# EasyEDA Pro project ws2812_clock_PCB.epro, schematic ws2812_broad
Create Date: 2024-04-24; Page Name: P1; Project Name: ws2812_clock; Schematic Name: ws2812_broad; Update Date: 2024-05-06; Company: 嘉立创EDA; Page Size: A3; Version: V1.0
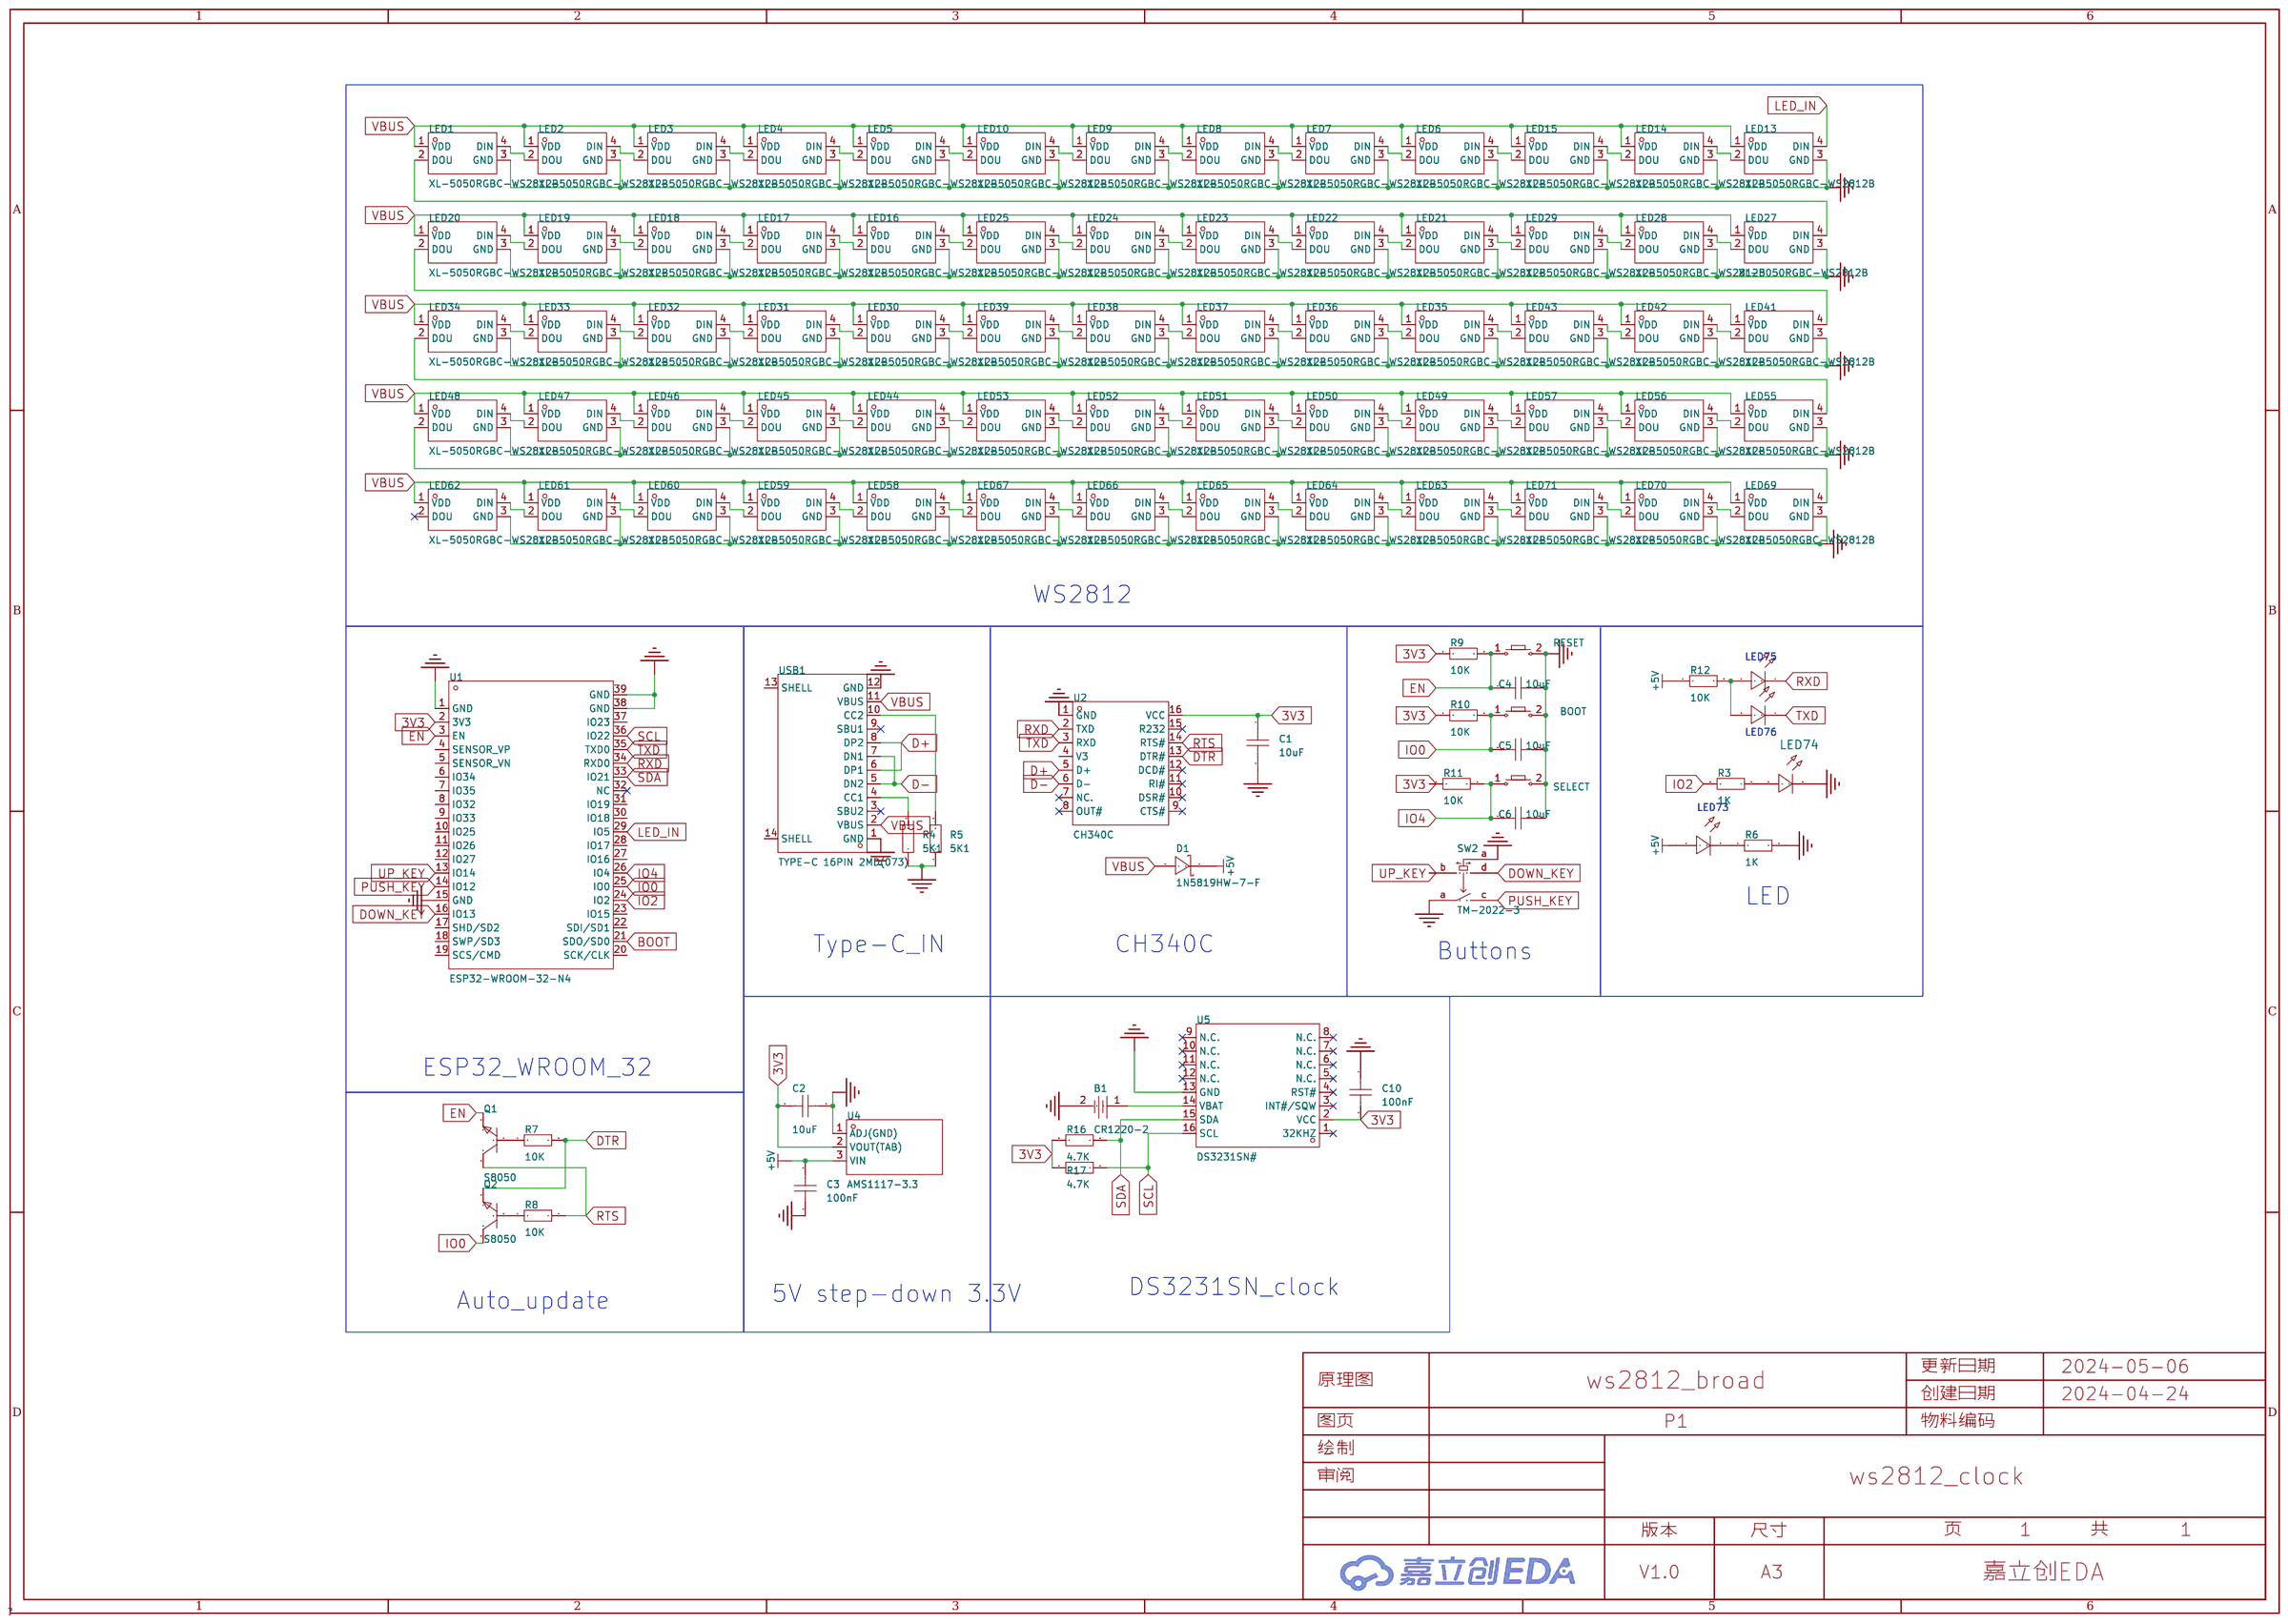
[diagram p1: schematic sheet]

## Parts
B1  CR1220-2  [BAT-SMD_CR1220-2]
BOOT  -  [Key_SMD_3x4x2]
C1  10uF  [C0603]
C2  10uF  [C0603]
C3  100nF  [C0603]
C4  10uF  [C0603]
C5  10uF  [C0603]
C6  10uF  [C0603]
C10  100nF  [C0603]
D1  1N5819HW-7-F  [SOD-123_L2.7-W1.6-LS3.7-RD]
LED1  XL-5050RGBC-WS2812B  [LED-SMD_4P-L5.0-W5.0-BL_XL-5050RGBC]
LED2  XL-5050RGBC-WS2812B  [LED-SMD_4P-L5.0-W5.0-BL_XL-5050RGBC]
LED3  XL-5050RGBC-WS2812B  [LED-SMD_4P-L5.0-W5.0-BL_XL-5050RGBC]
LED4  XL-5050RGBC-WS2812B  [LED-SMD_4P-L5.0-W5.0-BL_XL-5050RGBC]
LED5  XL-5050RGBC-WS2812B  [LED-SMD_4P-L5.0-W5.0-BL_XL-5050RGBC]
LED6  XL-5050RGBC-WS2812B  [LED-SMD_4P-L5.0-W5.0-BL_XL-5050RGBC]
LED7  XL-5050RGBC-WS2812B  [LED-SMD_4P-L5.0-W5.0-BL_XL-5050RGBC]
LED8  XL-5050RGBC-WS2812B  [LED-SMD_4P-L5.0-W5.0-BL_XL-5050RGBC]
LED9  XL-5050RGBC-WS2812B  [LED-SMD_4P-L5.0-W5.0-BL_XL-5050RGBC]
LED10  XL-5050RGBC-WS2812B  [LED-SMD_4P-L5.0-W5.0-BL_XL-5050RGBC]
LED13  XL-5050RGBC-WS2812B  [LED-SMD_4P-L5.0-W5.0-BL_XL-5050RGBC]
LED14  XL-5050RGBC-WS2812B  [LED-SMD_4P-L5.0-W5.0-BL_XL-5050RGBC]
LED15  XL-5050RGBC-WS2812B  [LED-SMD_4P-L5.0-W5.0-BL_XL-5050RGBC]
LED16  XL-5050RGBC-WS2812B  [LED-SMD_4P-L5.0-W5.0-BL_XL-5050RGBC]
LED17  XL-5050RGBC-WS2812B  [LED-SMD_4P-L5.0-W5.0-BL_XL-5050RGBC]
LED18  XL-5050RGBC-WS2812B  [LED-SMD_4P-L5.0-W5.0-BL_XL-5050RGBC]
LED19  XL-5050RGBC-WS2812B  [LED-SMD_4P-L5.0-W5.0-BL_XL-5050RGBC]
LED20  XL-5050RGBC-WS2812B  [LED-SMD_4P-L5.0-W5.0-BL_XL-5050RGBC]
LED21  XL-5050RGBC-WS2812B  [LED-SMD_4P-L5.0-W5.0-BL_XL-5050RGBC]
LED22  XL-5050RGBC-WS2812B  [LED-SMD_4P-L5.0-W5.0-BL_XL-5050RGBC]
LED23  XL-5050RGBC-WS2812B  [LED-SMD_4P-L5.0-W5.0-BL_XL-5050RGBC]
LED24  XL-5050RGBC-WS2812B  [LED-SMD_4P-L5.0-W5.0-BL_XL-5050RGBC]
LED25  XL-5050RGBC-WS2812B  [LED-SMD_4P-L5.0-W5.0-BL_XL-5050RGBC]
LED27  XL-5050RGBC-WS2812B  [LED-SMD_4P-L5.0-W5.0-BL_XL-5050RGBC]
LED28  XL-5050RGBC-WS2812B  [LED-SMD_4P-L5.0-W5.0-BL_XL-5050RGBC]
LED29  XL-5050RGBC-WS2812B  [LED-SMD_4P-L5.0-W5.0-BL_XL-5050RGBC]
LED30  XL-5050RGBC-WS2812B  [LED-SMD_4P-L5.0-W5.0-BL_XL-5050RGBC]
LED31  XL-5050RGBC-WS2812B  [LED-SMD_4P-L5.0-W5.0-BL_XL-5050RGBC]
LED32  XL-5050RGBC-WS2812B  [LED-SMD_4P-L5.0-W5.0-BL_XL-5050RGBC]
LED33  XL-5050RGBC-WS2812B  [LED-SMD_4P-L5.0-W5.0-BL_XL-5050RGBC]
LED34  XL-5050RGBC-WS2812B  [LED-SMD_4P-L5.0-W5.0-BL_XL-5050RGBC]
LED35  XL-5050RGBC-WS2812B  [LED-SMD_4P-L5.0-W5.0-BL_XL-5050RGBC]
LED36  XL-5050RGBC-WS2812B  [LED-SMD_4P-L5.0-W5.0-BL_XL-5050RGBC]
LED37  XL-5050RGBC-WS2812B  [LED-SMD_4P-L5.0-W5.0-BL_XL-5050RGBC]
LED38  XL-5050RGBC-WS2812B  [LED-SMD_4P-L5.0-W5.0-BL_XL-5050RGBC]
LED39  XL-5050RGBC-WS2812B  [LED-SMD_4P-L5.0-W5.0-BL_XL-5050RGBC]
LED41  XL-5050RGBC-WS2812B  [LED-SMD_4P-L5.0-W5.0-BL_XL-5050RGBC]
LED42  XL-5050RGBC-WS2812B  [LED-SMD_4P-L5.0-W5.0-BL_XL-5050RGBC]
LED43  XL-5050RGBC-WS2812B  [LED-SMD_4P-L5.0-W5.0-BL_XL-5050RGBC]
LED44  XL-5050RGBC-WS2812B  [LED-SMD_4P-L5.0-W5.0-BL_XL-5050RGBC]
LED45  XL-5050RGBC-WS2812B  [LED-SMD_4P-L5.0-W5.0-BL_XL-5050RGBC]
LED46  XL-5050RGBC-WS2812B  [LED-SMD_4P-L5.0-W5.0-BL_XL-5050RGBC]
LED47  XL-5050RGBC-WS2812B  [LED-SMD_4P-L5.0-W5.0-BL_XL-5050RGBC]
LED48  XL-5050RGBC-WS2812B  [LED-SMD_4P-L5.0-W5.0-BL_XL-5050RGBC]
LED49  XL-5050RGBC-WS2812B  [LED-SMD_4P-L5.0-W5.0-BL_XL-5050RGBC]
LED50  XL-5050RGBC-WS2812B  [LED-SMD_4P-L5.0-W5.0-BL_XL-5050RGBC]
LED51  XL-5050RGBC-WS2812B  [LED-SMD_4P-L5.0-W5.0-BL_XL-5050RGBC]
LED52  XL-5050RGBC-WS2812B  [LED-SMD_4P-L5.0-W5.0-BL_XL-5050RGBC]
LED53  XL-5050RGBC-WS2812B  [LED-SMD_4P-L5.0-W5.0-BL_XL-5050RGBC]
LED55  XL-5050RGBC-WS2812B  [LED-SMD_4P-L5.0-W5.0-BL_XL-5050RGBC]
LED56  XL-5050RGBC-WS2812B  [LED-SMD_4P-L5.0-W5.0-BL_XL-5050RGBC]
LED57  XL-5050RGBC-WS2812B  [LED-SMD_4P-L5.0-W5.0-BL_XL-5050RGBC]
LED58  XL-5050RGBC-WS2812B  [LED-SMD_4P-L5.0-W5.0-BL_XL-5050RGBC]
LED59  XL-5050RGBC-WS2812B  [LED-SMD_4P-L5.0-W5.0-BL_XL-5050RGBC]
LED60  XL-5050RGBC-WS2812B  [LED-SMD_4P-L5.0-W5.0-BL_XL-5050RGBC]
LED61  XL-5050RGBC-WS2812B  [LED-SMD_4P-L5.0-W5.0-BL_XL-5050RGBC]
LED62  XL-5050RGBC-WS2812B  [LED-SMD_4P-L5.0-W5.0-BL_XL-5050RGBC]
LED63  XL-5050RGBC-WS2812B  [LED-SMD_4P-L5.0-W5.0-BL_XL-5050RGBC]
LED64  XL-5050RGBC-WS2812B  [LED-SMD_4P-L5.0-W5.0-BL_XL-5050RGBC]
LED65  XL-5050RGBC-WS2812B  [LED-SMD_4P-L5.0-W5.0-BL_XL-5050RGBC]
LED66  XL-5050RGBC-WS2812B  [LED-SMD_4P-L5.0-W5.0-BL_XL-5050RGBC]
LED67  XL-5050RGBC-WS2812B  [LED-SMD_4P-L5.0-W5.0-BL_XL-5050RGBC]
LED69  XL-5050RGBC-WS2812B  [LED-SMD_4P-L5.0-W5.0-BL_XL-5050RGBC]
LED70  XL-5050RGBC-WS2812B  [LED-SMD_4P-L5.0-W5.0-BL_XL-5050RGBC]
LED71  XL-5050RGBC-WS2812B  [LED-SMD_4P-L5.0-W5.0-BL_XL-5050RGBC]
LED73  -  [LED_0603]
LED74  -  [LED_0603]
LED75  -  [LED_0603]
LED76  -  [LED_0603]
Q1  S8050  [SOT-23-3_L2.9-W1.3-P1.90-LS2.4-BR]
Q2  S8050  [SOT-23-3_L2.9-W1.3-P1.90-LS2.4-BR]
R3  1K  [R0603]
R4  5K1  [R0603]
R5  5K1  [R0603]
R6  1K  [R0603]
R7  10K  [R0603]
R8  10K  [R0603]
R9  10K  [R0603]
R10  10K  [R0603]
R11  10K  [R0603]
R12  10K  [R0603]
R16  4.7K  [R0603]
R17  4.7K  [R0603]
RESET  -  [Key_SMD_3x4x2]
SELECT  -  [Key_SMD_3x4x2]
SW2  TM-2022-3  [SW-SMD_TM-2022-3]
U1  ESP32-WROOM-32-N4  [WIFIM-SMD_ESP32-WROOM-32-N4]
U2  CH340C  [SOP-16_L10.0-W3.9-P1.27-LS6.0-BL]
U4  AMS1117-3.3  [SOT-89_L4.5-W2.5-P1.50-LS4.2-BR]
U5  DS3231SN#  [SOIC-16_L10.3-W7.5-P1.27-LS10.3-BL]
USB1  TYPE-C 16PIN 2MD(073)  [USB-C-SMD_TYPE-C-6PIN-2MD-073]

## Library data of the parts
B1 = CR1220-2: 连接器类型:电池底座;适用电池规格:CR1220;工作温度范围:-;; LCSC Part Name: 电池底座 适用电池:CR1220; Supplier Part: C70381; Manufacturer: Q&J; Supplier Footprint: SMD; JLCPCB Part Class: 扩展库; Datasheet: https://atta.szlcsc.com/upload/public/pdf/source/20160427/1461725216696.pdf; Supplier: LCSC; Connector Type: 电池底座; Battery Type: CR1220
BOOT RESET SELECT = Key_SMD_3x4x2: Supplier Footprint: SMD
C1-C6 C10 = CAP_0603: Supplier Footprint: 0603
D1 = 1N5819HW-7-F: 正向压降(Vf):450mV@1A;直流反向耐压(Vr):40V;平均整流电流(Io):1A;; LCSC Part Name: 电压:40V 电流:1A; Supplier Part: C82544; Manufacturer: DIODES(美台); Supplier Footprint: SOD-123; JLCPCB Part Class: 扩展库; Datasheet: https://atta.szlcsc.com/upload/public/pdf/source/20161024/1477288459223.pdf; Supplier: LCSC; Forward Voltage (Vf@If): 450mV@1A; Reverse Voltage (Vr): 40V; Average Rectified Current (Io): 1A; Reverse Leakage Current (Ir): 1mA@40V
LED1-LED10 LED13-LED25 LED27-LED39 LED41-LED53 LED55-LED67 LED69-LED71 = XL-5050RGBC-WS2812B: 发光颜色:RGB三色;功率:-;正向电流:-;主波长:-;二极管配置:-;透镜颜色:无色透明透镜;色温:-;发光角度:120°;载带方式:正贴;工作温度:-20℃~+85℃;; Supplier Part: C2843785; Manufacturer: XINGLIGHT(成兴光); Supplier Footprint: SMD5050; JLCPCB Part Class: 扩展库; Datasheet: https://atta.szlcsc.com/upload/public/pdf/source/20230111/86AAD2096485A2E5BCAB883FF8CBE6FD.pdf; Supplier: LCSC; Emitted Color: RGB三色; Peak Wavelength: 625nm；470nm；530nm; Lens Color: 无色透明透镜; Viewing Angle: 120°; Mounting Sytle: 正贴; Operating Temperature: -20℃~+85℃
LED73 LED76 = LED_0603-B: Supplier Footprint: 0603
LED74 = LED_0603-R: Supplier Footprint: 0603
LED75 = LED_0603-G: Supplier Footprint: 0603
Q1 Q2 = S8050_C2891804: 晶体管类型:NPN;集电极电流(Ic):500mA;集射极击穿电压(Vceo):25V;功率(Pd):300mW;; LCSC Part Name: NPN 电流:500mA 耐压:25V; Supplier Part: C2891804; Manufacturer: YONGYUTAI(永裕泰); Supplier Footprint: SOT-23; JLCPCB Part Class: 扩展库; Datasheet: https://atta.szlcsc.com/upload/public/pdf/source/20210901/5347316A10609C628D4D69AE01446E5B.pdf; Supplier: LCSC; Transistor Type: NPN; Collector Current (Ic): 500mA; Collector-Emitter Breakdown Voltage (Vceo): 25V; Power Dissipation (Pd): 300mW; Collector Cut-Off Current (Icbo): 1uA; Collector-Emitter Saturation Voltage (VCE(sat)@Ic,Ib): 500mV@500mA,50mA
R3-R12 R16 R17 = Res_0603: Supplier Footprint: 0603
SW2 = TM-2022-3: 数码相机拨轮开关  3挡拨轮开关; LCSC Part Name: 数码相机拨轮开关  3挡拨轮开关; Supplier Part: C318952; Manufacturer: XKB Connectivity(中国星坤); Supplier Footprint: SMD-5P,11.4x12.8mm; JLCPCB Part Class: 扩展库; Datasheet: https://atta.szlcsc.com/upload/public/pdf/source/20211015/3476D939D9FB2BD124C91E3A6F460D4F.pdf; Supplier: LCSC
U1 = ESP32-WROOM-32-N4: WiFi+蓝牙4.2+双核CPU,ESP32; LCSC Part Name: WiFi+蓝牙4.2+双核CPU模块; Supplier Part: C82899; Manufacturer: ESPRESSIF(乐鑫); Supplier Footprint: SMD,18x25.5mm; JLCPCB Part Class: 扩展库; Datasheet: https://atta.szlcsc.com/upload/public/pdf/source/20210719/C82899_2D52724B6FAFABC419BCF308C5944296.pdf; Supplier: LCSC
U2 = CH340C: 应用功能:收发器;接口协议:USB 2.0;数据速率:2Mbps;; LCSC Part Name: CH340C USB转串口芯片 CH340; Supplier Part: C84681; Manufacturer: WCH(南京沁恒); Supplier Footprint: SOP-16; JLCPCB Part Class: 扩展库; Datasheet: https://atta.szlcsc.com/upload/public/pdf/source/20200819/C84681_ADBED554CE321879DBD6B1D06488689C.pdf; Supplier: LCSC; Applications Function: 收发器; Protocol: USB 2.0; Supply Voltage: 3.3V；5V; Data Rate: 2Mbps
U4 = AMS1117-3.3_C347256: 输出类型:固定;最大输入电压:12V;输出电压:3.3V;最大输出电流:1A;电源纹波抑制比(PSRR):60dB@(120Hz);输出极性:正极;; LCSC Part Name: 输出:3.3V 电流:1A 耐压:12V; Supplier Part: C347256; Manufacturer: UMW(友台半导体); Supplier Footprint: SOT-89; JLCPCB Part Class: 扩展库; Datasheet: https://atta.szlcsc.com/upload/public/pdf/source/20231109/155D79A26D9DB04352555A58D5969DC8.pdf; Supplier: LCSC; Output Type: 固定; Maximum Input Voltage: 12V; Output Voltage: 3.3V; MAX Output Current: 1A; Power Supply Rejection Ratio (PSRR): 60dB@(120Hz); Dropout Voltage: 1.3V@(1A); Output Polarity: 正极; Number of Outputs: 1
U5 = DS3231SN#: 接口:I2C;; Supplier Part: C722469; Manufacturer: ADI(亚德诺)/MAXIM(美信); Supplier Footprint: SOIC-16-300mil; JLCPCB Part Class: 扩展库; Datasheet: https://atta.szlcsc.com/upload/public/pdf/source/20170713/C118524_1499918908819816807.pdf; Supplier: LCSC; Interface: I2C; Operating Voltage: 2.3V~5.5V; Operating Temperature: -40℃~+85℃
USB1 = TYPE-C 16PIN 2MD(073): 连接器类型:Type-C;标准:-;公母:母;端口数量:1;触点数量:16P;安装方式:卧贴;额定电流 - 电源:5A;工作温度范围:-25℃~+85℃;; LCSC Part Name: Type-C 母 卧贴; Supplier Part: C2765186; Manufacturer: SHOU HAN(首韩); Supplier Footprint: SMD; JLCPCB Part Class: 扩展库; Datasheet: https://atta.szlcsc.com/upload/public/pdf/source/20211123/39B17C16241EAC15C5E277BDA434118E.pdf; Supplier: LCSC; Connector Type: Type-C; Gender: 母; Number of Ports: 1; Number of Contacts: 16P; Mounting Style: 卧贴; Current Rating - Power (Max): 5A; Operating Temperature Range: -25℃~+85℃

## Nets
3V3: C1.1 C2.1 C10.2 R9.1 R10.1 R11.1 R16.1 R17.1 U1.2(3V3) U2.16(VCC) U4.2(VOUT(TAB)) U5.2(VCC)
+5V: C3.2 D1.1(K) LED73.2(A) R12.1 U4.3(VIN)
GND: B1.2 BOOT.2 C1.2 C2.2 C3.1 C4.2 C5.2 C6.2 C10.1 LED1.3(GND) LED2.3(GND) LED3.3(GND) LED4.3(GND) LED5.3(GND) LED6.3(GND) LED7.3(GND) LED8.3(GND) LED9.3(GND) LED10.3(GND) LED13.3(GND) LED14.3(GND) LED15.3(GND) LED16.3(GND) LED17.3(GND) LED18.3(GND) LED19.3(GND) LED20.3(GND) LED21.3(GND) LED22.3(GND) LED23.3(GND) LED24.3(GND) LED25.3(GND) LED27.3(GND) LED28.3(GND) LED29.3(GND) LED30.3(GND) LED31.3(GND) LED32.3(GND) LED33.3(GND) LED34.3(GND) LED35.3(GND) LED36.3(GND) LED37.3(GND) LED38.3(GND) LED39.3(GND) LED41.3(GND) LED42.3(GND) LED43.3(GND) LED44.3(GND) LED45.3(GND) LED46.3(GND) LED47.3(GND) LED48.3(GND) LED49.3(GND) LED50.3(GND) LED51.3(GND) LED52.3(GND) LED53.3(GND) LED55.3(GND) LED56.3(GND) LED57.3(GND) LED58.3(GND) LED59.3(GND) LED60.3(GND) LED61.3(GND) LED62.3(GND) LED63.3(GND) LED64.3(GND) LED65.3(GND) LED66.3(GND) LED67.3(GND) LED69.3(GND) LED70.3(GND) LED71.3(GND) LED74.1(C) R4.1 R5.1 R6.2 RESET.2 SELECT.2 SW2.a U1.1(GND) U1.15(GND) U1.38(GND) U1.39(GND) U2.1(GND) U4.1(ADJ(GND)) U5.13(GND) USB1.1(GND) USB1.12(GND)
VBUS: D1.2(A) LED1.1(VDD) LED2.1(VDD) LED3.1(VDD) LED4.1(VDD) LED5.1(VDD) LED6.1(VDD) LED7.1(VDD) LED8.1(VDD) LED9.1(VDD) LED10.1(VDD) LED13.1(VDD) LED14.1(VDD) LED15.1(VDD) LED16.1(VDD) LED17.1(VDD) LED18.1(VDD) LED19.1(VDD) LED20.1(VDD) LED21.1(VDD) LED22.1(VDD) LED23.1(VDD) LED24.1(VDD) LED25.1(VDD) LED27.1(VDD) LED28.1(VDD) LED29.1(VDD) LED30.1(VDD) LED31.1(VDD) LED32.1(VDD) LED33.1(VDD) LED34.1(VDD) LED35.1(VDD) LED36.1(VDD) LED37.1(VDD) LED38.1(VDD) LED39.1(VDD) LED41.1(VDD) LED42.1(VDD) LED43.1(VDD) LED44.1(VDD) LED45.1(VDD) LED46.1(VDD) LED47.1(VDD) LED48.1(VDD) LED49.1(VDD) LED50.1(VDD) LED51.1(VDD) LED52.1(VDD) LED53.1(VDD) LED55.1(VDD) LED56.1(VDD) LED57.1(VDD) LED58.1(VDD) LED59.1(VDD) LED60.1(VDD) LED61.1(VDD) LED62.1(VDD) LED63.1(VDD) LED64.1(VDD) LED65.1(VDD) LED66.1(VDD) LED67.1(VDD) LED69.1(VDD) LED70.1(VDD) LED71.1(VDD) USB1.2(VBUS) USB1.11(VBUS)
BOOT: U1.21(SDO/SD0)
D+: U2.5(D+) USB1.6(DP1) USB1.8(DP2)
D-: U2.6(D-) USB1.5(DN2) USB1.7(DN1)
DOWN_KEY: SW2.d U1.16(IO13)
DTR: Q2.2(E) R7.2 U2.13(DTR#)
EN: C4.1 Q1.2(E) R9.2 RESET.1 U1.3(EN)
IO0: BOOT.1 C5.1 Q2.3(C) R10.2 U1.25(IO0)
IO2: R3.2 U1.24(IO2)
IO4: C6.1 R11.2 SELECT.1 U1.26(IO4)
LED_IN: LED13.4(DIN) U1.29(IO5)
PUSH_KEY: SW2.c U1.14(IO12)
RTS: Q1.3(C) R8.2 U2.14(RTS#)
RXD: LED75.1(C) U1.34(RXD0) U2.2(TXD)
SCL: R17.2 U1.36(IO22) U5.16(SCL)
SDA: R16.2 U1.33(IO21) U5.15(SDA)
TXD: LED76.1(C) U1.35(TXD0) U2.3(RXD)
UP_KEY: SW2.b U1.13(IO14)
$1N4092: LED13.2(DOU) LED14.4(DIN)
$1N4097: LED7.2(DOU) LED8.4(DIN)
$1N4102: LED6.2(DOU) LED7.4(DIN)
$1N4107: LED8.2(DOU) LED9.4(DIN)
$1N4112: LED9.2(DOU) LED10.4(DIN)
$1N4117: LED5.4(DIN) LED10.2(DOU)
$1N4122: LED4.4(DIN) LED5.2(DOU)
$1N4127: LED1.4(DIN) LED2.2(DOU)
$1N5780: LED6.4(DIN) LED15.2(DOU)
$1N5785: LED14.2(DOU) LED15.4(DIN)
$1N5790: LED2.4(DIN) LED3.2(DOU)
$1N5795: LED3.4(DIN) LED4.2(DOU)
$1N7419: LED19.2(DOU) LED20.4(DIN)
$1N7423: LED18.2(DOU) LED19.4(DIN)
$1N7427: LED17.2(DOU) LED18.4(DIN)
$1N7431: LED16.2(DOU) LED17.4(DIN)
$1N7435: LED16.4(DIN) LED25.2(DOU)
$1N7439: LED24.2(DOU) LED25.4(DIN)
$1N7443: LED23.2(DOU) LED24.4(DIN)
$1N7447: LED22.2(DOU) LED23.4(DIN)
$1N7451: LED21.2(DOU) LED22.4(DIN)
$1N7455: LED21.4(DIN) LED29.2(DOU)
$1N7459: LED28.2(DOU) LED29.4(DIN)
$1N7463: LED27.2(DOU) LED28.4(DIN)
$1N7531: LED1.2(DOU) LED27.4(DIN)
$1N9831: LED33.2(DOU) LED34.4(DIN)
$1N9835: LED32.2(DOU) LED33.4(DIN)
$1N9839: LED31.2(DOU) LED32.4(DIN)
$1N9843: LED30.2(DOU) LED31.4(DIN)
$1N9847: LED30.4(DIN) LED39.2(DOU)
$1N9851: LED38.2(DOU) LED39.4(DIN)
$1N9855: LED37.2(DOU) LED38.4(DIN)
$1N9859: LED36.2(DOU) LED37.4(DIN)
$1N9863: LED35.2(DOU) LED36.4(DIN)
$1N9867: LED35.4(DIN) LED43.2(DOU)
$1N9871: LED42.2(DOU) LED43.4(DIN)
$1N9875: LED41.2(DOU) LED42.4(DIN)
$1N10622: LED47.2(DOU) LED48.4(DIN)
$1N10626: LED46.2(DOU) LED47.4(DIN)
$1N10630: LED45.2(DOU) LED46.4(DIN)
$1N10634: LED44.2(DOU) LED45.4(DIN)
$1N10638: LED44.4(DIN) LED53.2(DOU)
$1N10642: LED52.2(DOU) LED53.4(DIN)
$1N10646: LED51.2(DOU) LED52.4(DIN)
$1N10650: LED50.2(DOU) LED51.4(DIN)
$1N10654: LED49.2(DOU) LED50.4(DIN)
$1N10658: LED49.4(DIN) LED57.2(DOU)
$1N10662: LED56.2(DOU) LED57.4(DIN)
$1N10666: LED55.2(DOU) LED56.4(DIN)
$1N11413: LED61.2(DOU) LED62.4(DIN)
$1N11417: LED60.2(DOU) LED61.4(DIN)
$1N11421: LED59.2(DOU) LED60.4(DIN)
$1N11425: LED58.2(DOU) LED59.4(DIN)
$1N11429: LED58.4(DIN) LED67.2(DOU)
$1N11433: LED66.2(DOU) LED67.4(DIN)
$1N11437: LED65.2(DOU) LED66.4(DIN)
$1N11441: LED64.2(DOU) LED65.4(DIN)
$1N11445: LED63.2(DOU) LED64.4(DIN)
$1N11449: LED63.4(DIN) LED71.2(DOU)
$1N11453: LED70.2(DOU) LED71.4(DIN)
$1N11457: LED69.2(DOU) LED70.4(DIN)
$1N11461: LED48.2(DOU) LED69.4(DIN)
$1N11531: LED20.2(DOU) LED41.4(DIN)
$1N11542: LED34.2(DOU) LED55.4(DIN)
$1N14391: R5.2 USB1.10(CC2)
$1N14400: R4.2 USB1.4(CC1)
$1N15566: LED73.1(C) R6.1
$1N15790: Q1.1(B) R7.1
$1N15816: Q2.1(B) R8.1
$1N18906: LED74.2(A) R3.1
$1N24522: LED75.2(A) LED76.2(A) R12.2
$1N28114: B1.1 U5.14(VBAT)

Not connected (* = marked no-connect by the designer): LED62 2(DOU)*; U1 4(SENSOR_VP) 5(SENSOR_VN) 6(IO34) 7(IO35) 8(IO32) 9(IO33) 10(IO25) 11(IO26) 12(IO27) 17(SHD/SD2) 18(SWP/SD3) 19(SCS/CMD) 20(SCK/CLK) 22(SDI/SD1) 23(IO15) 27(IO16) 28(IO17) 30(IO18) 31(IO19) 32(NC)* 37(IO23); U2 4(V3) 7(NC.)* 8(OUT#)* 9(CTS#)* 10(DSR#)* 11(RI#)* 12(DCD#)* 15(R232)*; U5 1(32KHZ)* 3(INT#/SQW)* 4(RST#)* 5(N.C.)* 6(N.C.)* 7(N.C.)* 8(N.C.)* 9(N.C.)* 10(N.C.)* 11(N.C.)* 12(N.C.)*; USB1 3(SBU2)* 9(SBU1)* 13(SHELL) 14(SHELL)

## Notes on the sheet
- WS2812
- LED
- Type-C_IN
- CH340C
- Buttons
- ESP32_WROOM_32
- Auto_update
- 5V step-down 3.3V
- DS3231SN_clock
